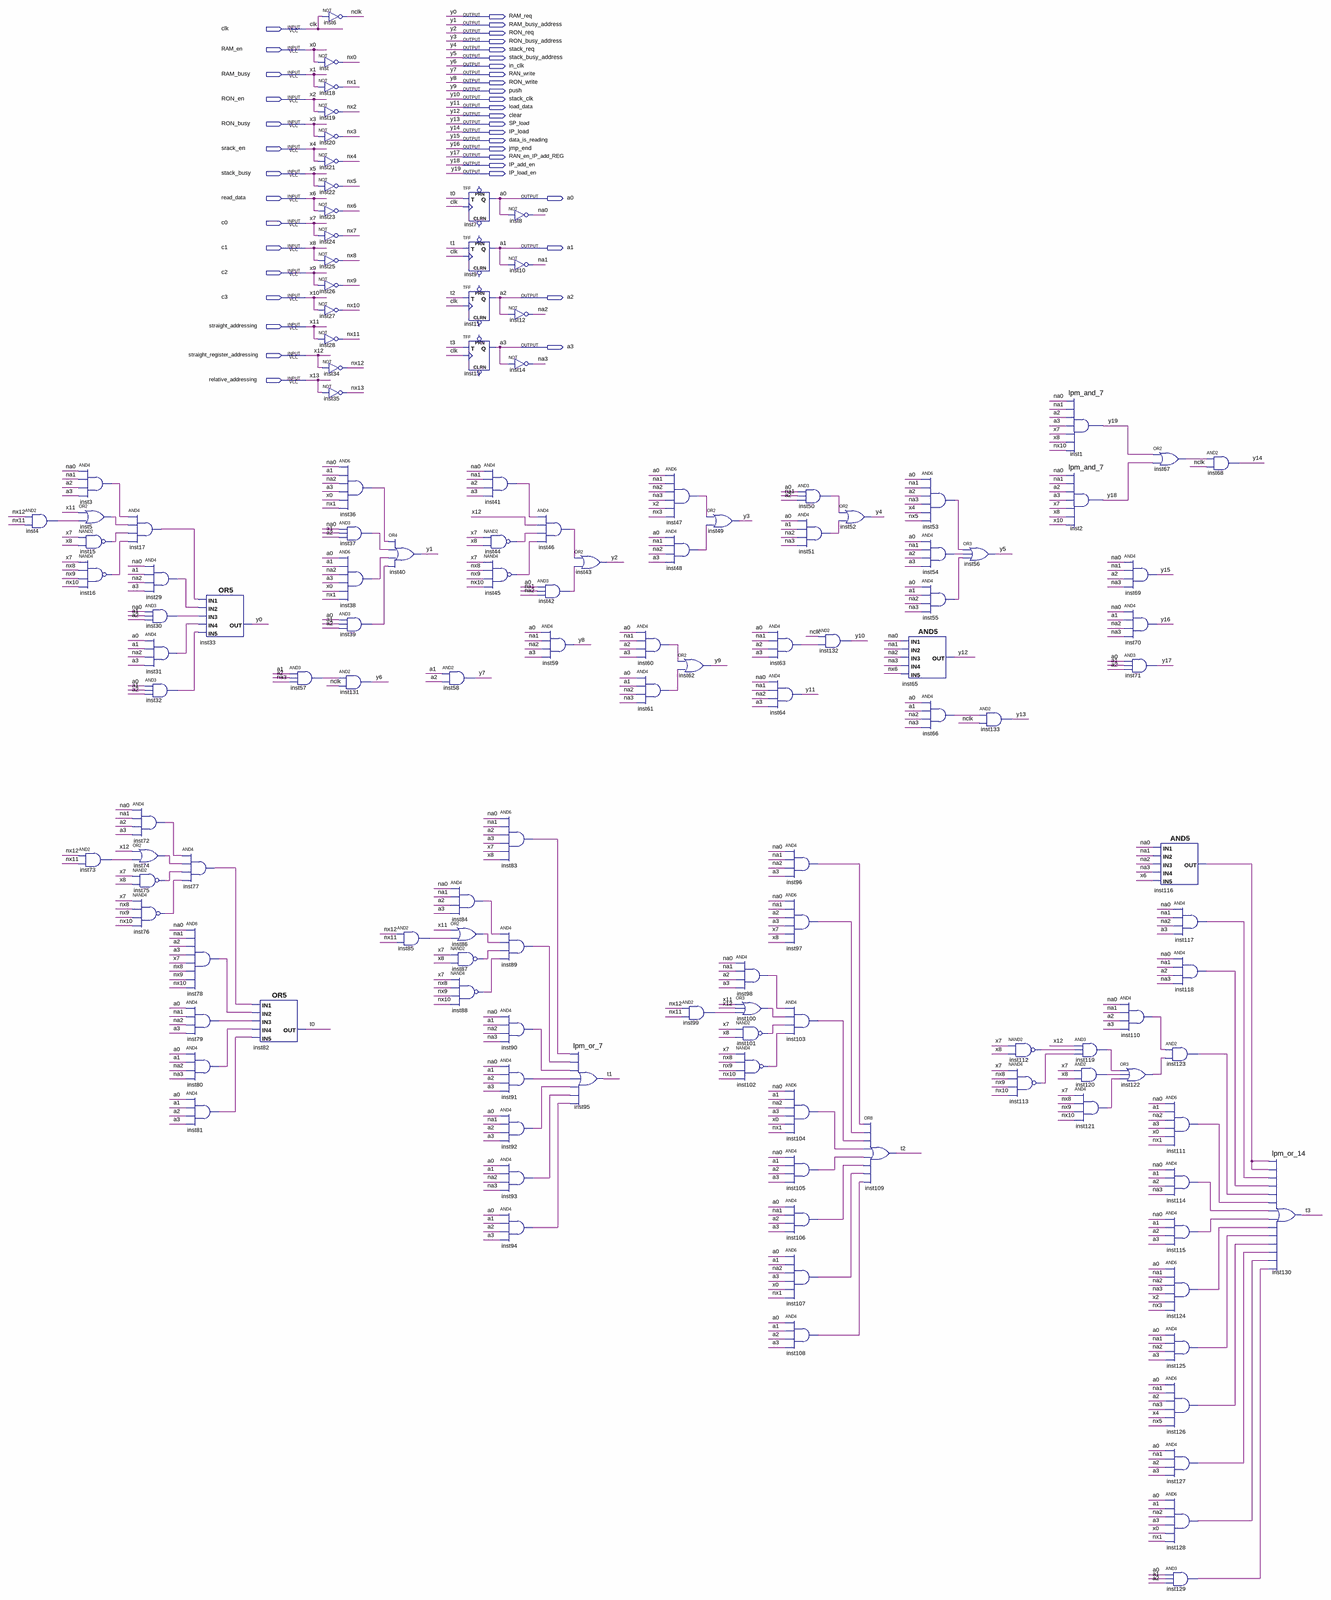
[diagram p0: schematic sheet, whole]
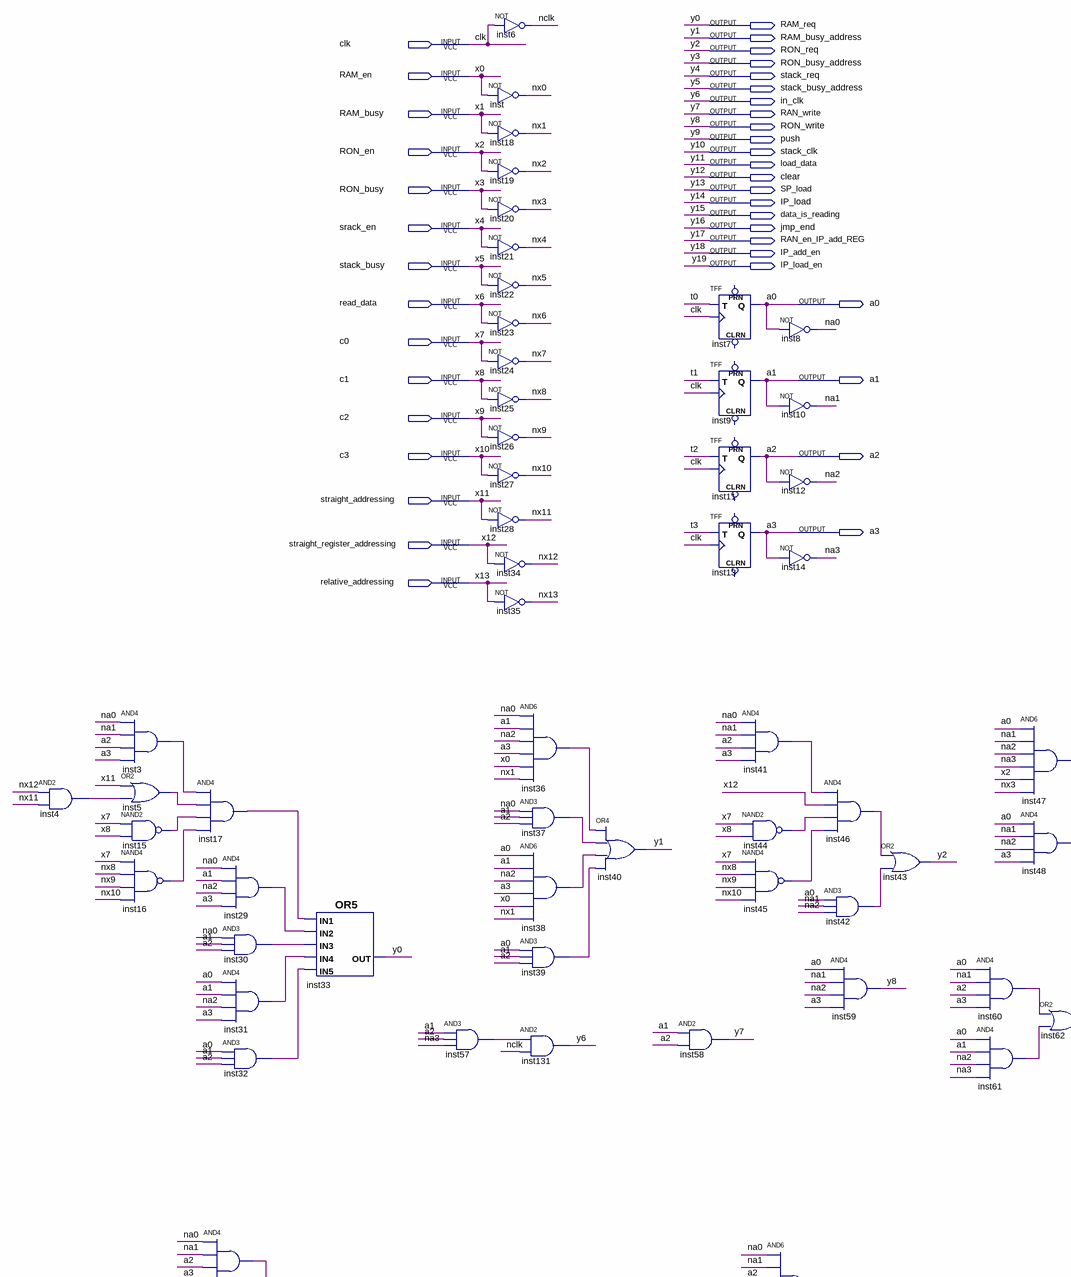
[diagram p1: schematic sheet, upper left part]
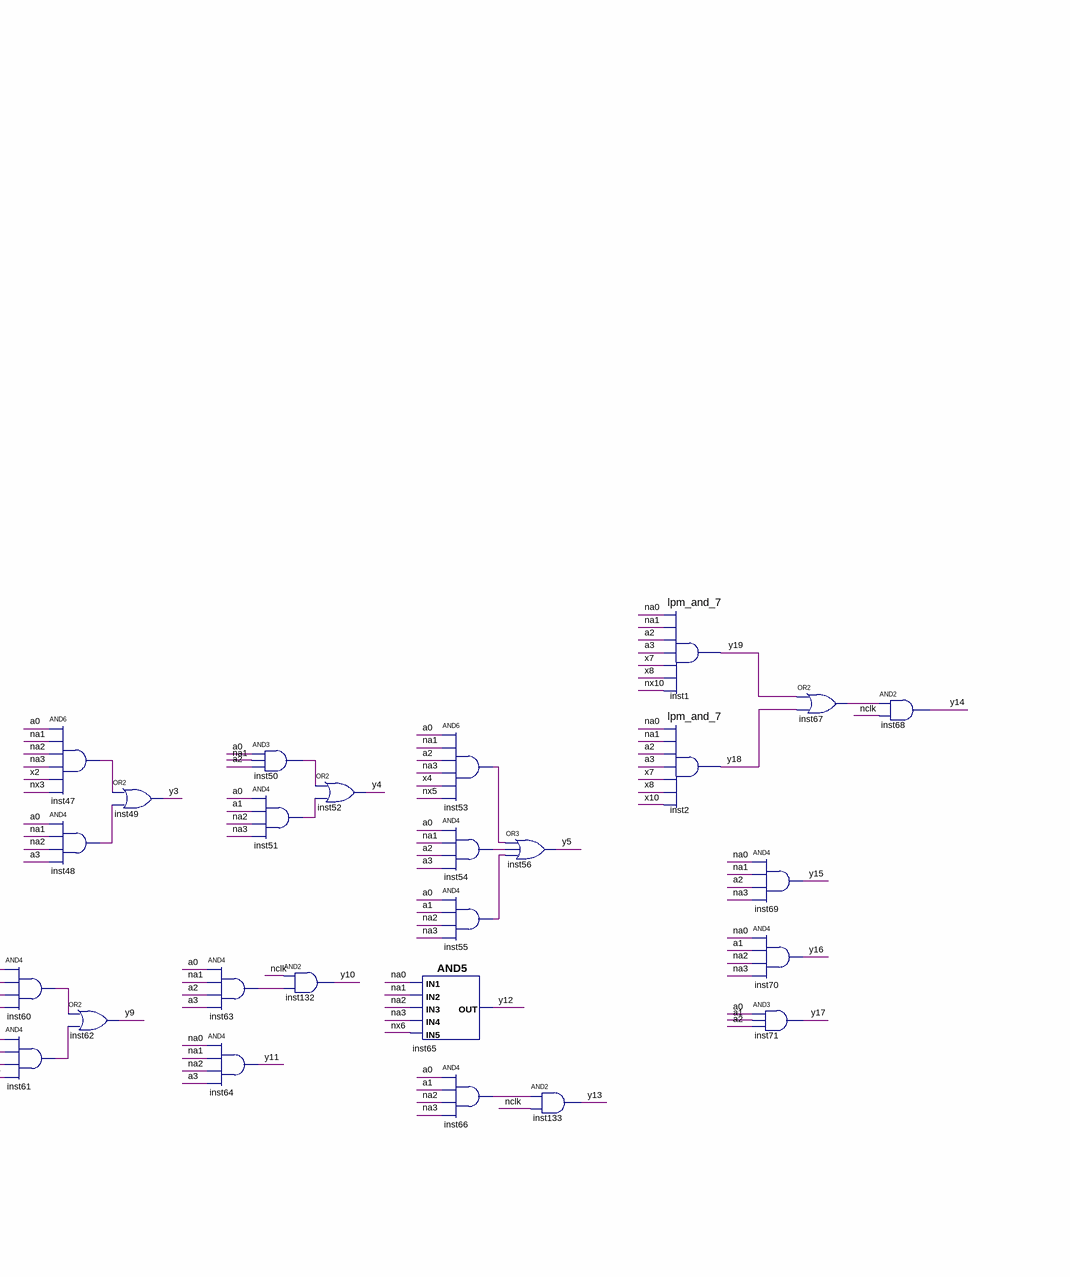
[diagram p2: schematic sheet, upper right part]
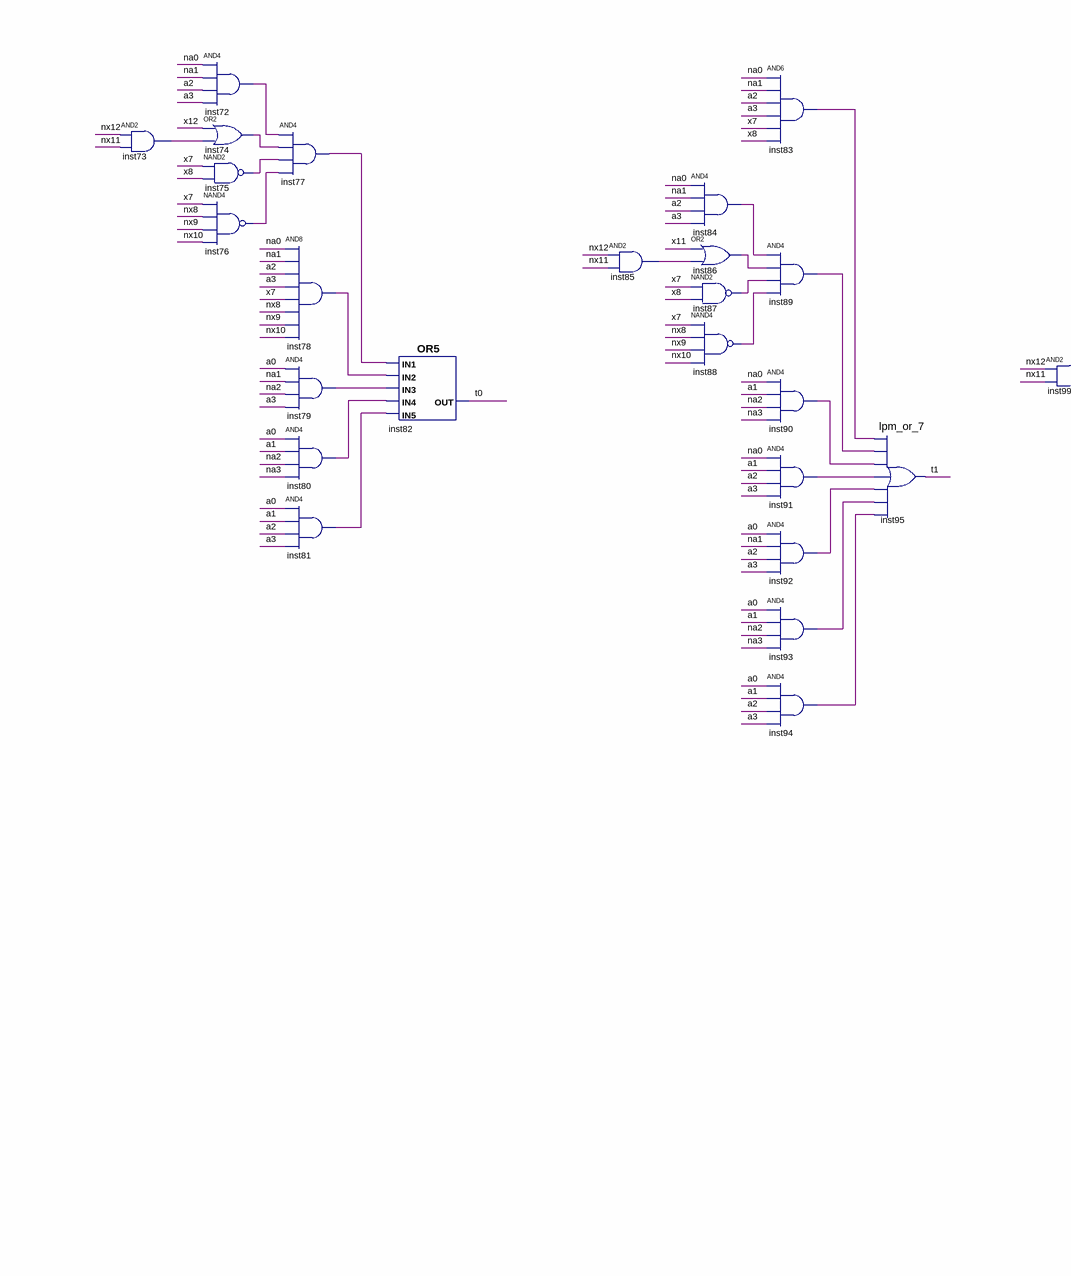
[diagram p3: schematic sheet, lower left part]
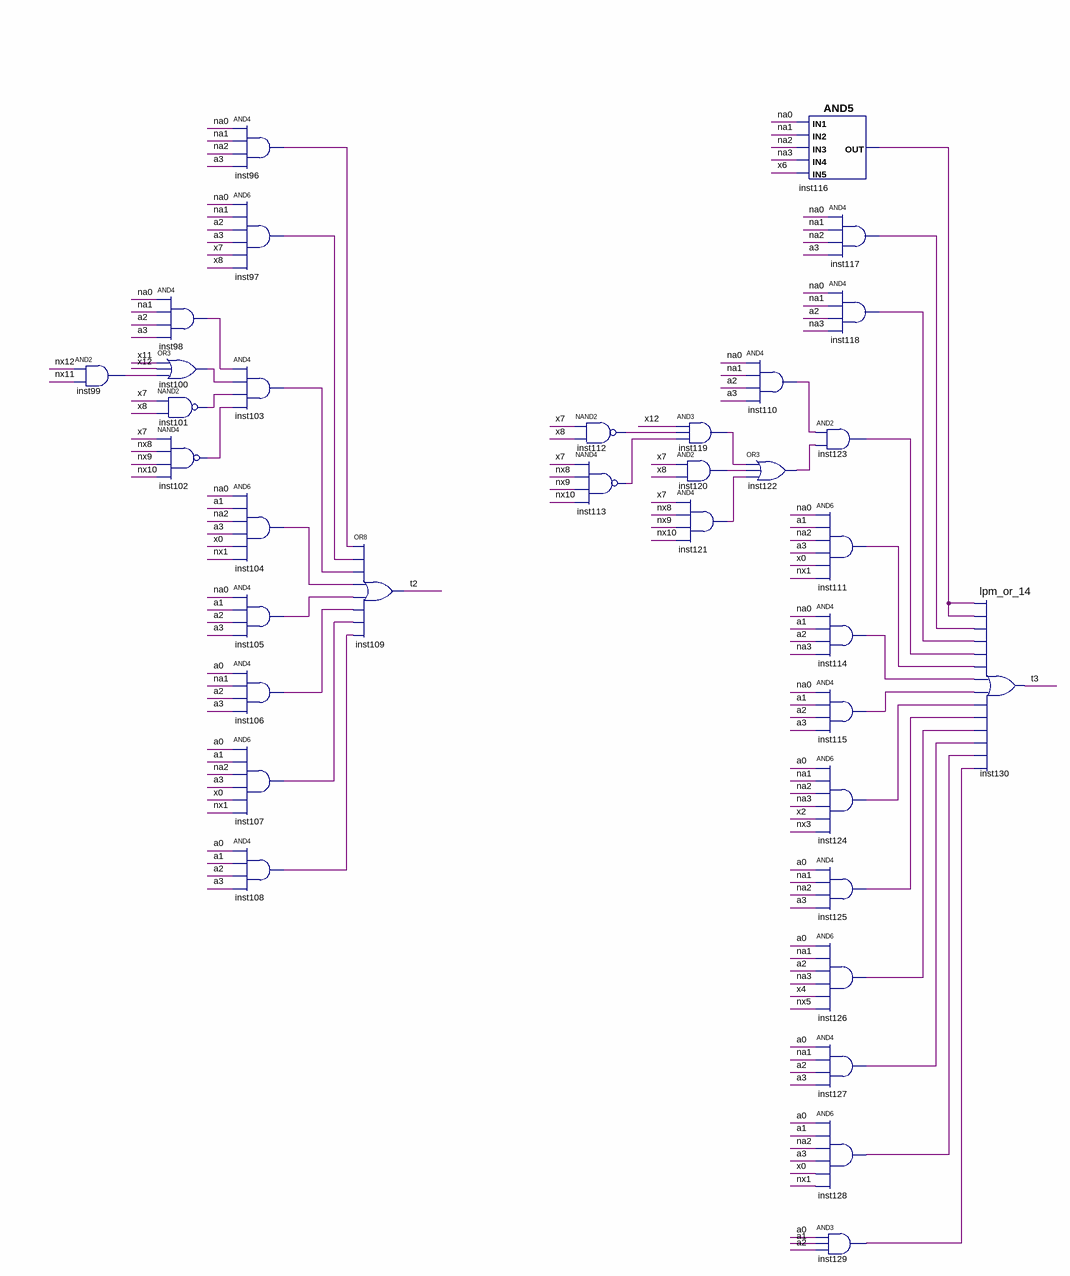
[diagram p4: schematic sheet, lower right part]
// Quartus schematic save_resault.bdf as structural Verilog: 134 symbols, 39 pins
module save_resault (
  input  clk,
  input  RAM_en,
  input  RAM_busy,
  input  RON_en,
  input  RON_busy,
  input  srack_en,
  input  stack_busy,
  input  read_data,
  input  c0,
  input  c1,
  input  c2,
  input  c3,
  input  straight_addressing,
  input  straight_register_addressing,
  input  relative_addressing,
  output RAM_req,
  output RAM_busy_address,
  output RON_req,
  output RON_busy_address,
  output stack_req,
  output stack_busy_address,
  output in_clk,
  output RAN_write,
  output RON_write,
  output push,
  output stack_clk,
  output load_data,
  output clear,
  output SP_load,
  output IP_load,
  output data_is_reading,
  output jmp_end,
  output RAN_en_IP_add_REG,
  output IP_add_en,
  output IP_load_en,
  output a0,
  output a1,
  output a2,
  output a3
);

  wire inst3_out, inst4_out, inst5_out, inst15_out, inst16_out, inst17_out, inst29_out, inst30_out,
       inst31_out, inst32_out, inst36_out, inst37_out, inst38_out, inst39_out, inst41_out, inst42_out,
       inst44_out, inst45_out, inst46_out, inst47_out, inst48_out, inst50_out, inst51_out, inst53_out,
       inst54_out, inst55_out, inst57_out, inst60_out, inst61_out, inst63_out, inst66_out, inst67_out,
       inst72_out, inst73_out, inst74_out, inst75_out, inst76_out, inst77_out, inst78_out, inst79_out,
       inst80_out, inst81_out, inst83_out, inst84_out, inst85_out, inst86_out, inst87_out, inst88_out,
       inst89_out, inst90_out, inst91_out, inst92_out, inst93_out, inst94_out, inst96_out, inst97_out,
       inst98_out, inst99_out, inst100_out, inst101_out, inst102_out, inst103_out, inst104_out, inst105_out,
       inst106_out, inst107_out, inst108_out, inst110_out, inst111_out, inst112_out, inst113_out,
       inst114_out, inst115_out, inst116_out, inst117_out, inst118_out, inst119_out, inst120_out,
       inst121_out, inst122_out, inst123_out, inst124_out, inst125_out, inst126_out, inst127_out,
       inst128_out, inst129_out, na0, na1, na2, na3, nclk, nx0, nx1, nx2, nx3, nx4, nx5, nx6, nx7, nx8, nx9,
       nx10, nx11, nx12, nx13, t0, t1, t2, t3;

  and inst4 (inst4_out, nx12, nx11);
  and inst3 (inst3_out, na0, na1, a2, a3);
  or inst5 (inst5_out, straight_addressing, inst4_out);
  nand inst15 (inst15_out, c0, c1);
  nand inst16 (inst16_out, c0, nx8, nx9, nx10);
  and inst73 (inst73_out, nx12, nx11);
  and inst17 (inst17_out, inst3_out, inst5_out, inst15_out, inst16_out);
  and inst72 (inst72_out, na0, na1, a2, a3);
  or inst74 (inst74_out, straight_register_addressing, inst73_out);
  nand inst75 (inst75_out, c0, c1);
  nand inst76 (inst76_out, c0, nx8, nx9, nx10);
  and inst29 (inst29_out, na0, a1, na2, a3);
  and inst30 (inst30_out, na0, a1, a2);
  and inst31 (inst31_out, a0, a1, na2, a3);
  and inst32 (inst32_out, a0, a1, a2);
  or inst33 (RAM_req, inst17_out, inst29_out, inst30_out, inst31_out, inst32_out);
  and inst77 (inst77_out, inst72_out, inst74_out, inst75_out, inst76_out);
  and inst78 (inst78_out, na0, na1, a2, a3, c0, nx8, nx9, nx10);
  and inst79 (inst79_out, a0, na1, na2, a3);
  and inst80 (inst80_out, a0, a1, na2, na3);
  and inst81 (inst81_out, a0, a1, a2, a3);
  or inst82 (t0, inst77_out, inst78_out, inst79_out, inst80_out, inst81_out);
  and inst57 (inst57_out, a1, a2, na3);
  not inst6 (nclk, clk);
  not inst (nx0, RAM_en);
  not inst18 (nx1, RAM_busy);
  not inst19 (nx2, RON_en);
  not inst20 (nx3, RON_busy);
  not inst21 (nx4, srack_en);
  not inst22 (nx5, stack_busy);
  not inst23 (nx6, read_data);
  not inst24 (nx7, c0);
  not inst25 (nx8, c1);
  not inst26 (nx9, c2);
  not inst27 (nx10, c3);
  not inst28 (nx11, straight_addressing);
  not inst34 (nx12, straight_register_addressing);
  not inst35 (nx13, relative_addressing);
  and inst36 (inst36_out, na0, a1, na2, a3, RAM_en, nx1);
  and inst37 (inst37_out, na0, a1, a2);
  and inst38 (inst38_out, a0, a1, na2, a3, RAM_en, nx1);
  and inst39 (inst39_out, a0, a1, a2);
  and inst131 (in_clk, inst57_out, nclk);
  or inst40 (RAM_busy_address, inst36_out, inst37_out, inst38_out, inst39_out);
  and inst85 (inst85_out, nx12, nx11);
  TFF inst7 (.T(t0), .CLK(clk), .Q(a0));  // open: PRN, CLRN
  TFF inst9 (.T(t1), .CLK(clk), .Q(a1));  // open: PRN, CLRN
  TFF inst11 (.T(t2), .CLK(clk), .Q(a2));  // open: PRN, CLRN
  TFF inst13 (.T(t3), .CLK(clk), .Q(a3));  // open: PRN, CLRN
  and inst58 (RAN_write, a1, a2);
  and inst84 (inst84_out, na0, na1, a2, a3);
  or inst86 (inst86_out, straight_addressing, inst85_out);
  nand inst87 (inst87_out, c0, c1);
  nand inst88 (inst88_out, c0, nx8, nx9, nx10);
  and inst41 (inst41_out, na0, na1, a2, a3);
  nand inst44 (inst44_out, c0, c1);
  nand inst45 (inst45_out, c0, nx8, nx9, nx10);
  and inst83 (inst83_out, na0, na1, a2, a3, c0, c1);
  and inst89 (inst89_out, inst84_out, inst86_out, inst87_out, inst88_out);
  and inst90 (inst90_out, na0, a1, na2, na3);
  and inst91 (inst91_out, na0, a1, a2, a3);
  and inst92 (inst92_out, a0, na1, a2, a3);
  and inst93 (inst93_out, a0, a1, na2, na3);
  and inst94 (inst94_out, a0, a1, a2, a3);
  not inst8 (na0, a0);
  not inst10 (na1, a1);
  not inst12 (na2, a2);
  not inst14 (na3, a3);
  and inst46 (inst46_out, inst41_out, straight_register_addressing, inst44_out, inst45_out);
  and inst42 (inst42_out, a0, na1, na2);
  and inst59 (RON_write, a0, na1, na2, a3);
  or inst43 (RON_req, inst46_out, inst42_out);
  lpm_or_7 inst95 (
    .data0(inst83_out), .data1(inst89_out), .data2(inst90_out), .data3(inst91_out), .data4(inst92_out),
    .data5(inst93_out), .data6(inst94_out), .result(t1));
  and inst47 (inst47_out, a0, na1, na2, na3, RON_en, nx3);
  and inst48 (inst48_out, a0, na1, na2, a3);
  and inst60 (inst60_out, a0, na1, a2, a3);
  and inst61 (inst61_out, a0, a1, na2, na3);
  or inst62 (push, inst60_out, inst61_out);
  and inst99 (inst99_out, nx12, nx11);
  or inst49 (RON_busy_address, inst47_out, inst48_out);
  and inst98 (inst98_out, na0, na1, a2, a3);
  or inst100 (inst100_out, straight_addressing, straight_register_addressing, inst99_out);
  nand inst101 (inst101_out, c0, c1);
  nand inst102 (inst102_out, c0, nx8, nx9, nx10);
  and inst50 (inst50_out, a0, na1, a2);
  and inst51 (inst51_out, a0, a1, na2, na3);
  and inst63 (inst63_out, a0, na1, a2, a3);
  and inst64 (load_data, na0, na1, na2, a3);
  and inst96 (inst96_out, na0, na1, na2, a3);
  and inst97 (inst97_out, na0, na1, a2, a3, c0, c1);
  and inst103 (inst103_out, inst98_out, inst100_out, inst101_out, inst102_out);
  and inst104 (inst104_out, na0, a1, na2, a3, RAM_en, nx1);
  and inst105 (inst105_out, na0, a1, a2, a3);
  and inst106 (inst106_out, a0, na1, a2, a3);
  and inst107 (inst107_out, a0, a1, na2, a3, RAM_en, nx1);
  and inst108 (inst108_out, a0, a1, a2, a3);
  and inst132 (stack_clk, nclk, inst63_out);
  or inst52 (stack_req, inst50_out, inst51_out);
  or inst109 (t2, inst96_out, inst97_out, inst103_out, inst104_out, inst105_out, inst106_out, inst107_out, inst108_out);
  and inst53 (inst53_out, a0, na1, a2, na3, srack_en, nx5);
  and inst54 (inst54_out, a0, na1, a2, a3);
  and inst55 (inst55_out, a0, a1, na2, na3);
  and inst65 (clear, na0, na1, na2, na3, nx6);
  and inst66 (inst66_out, a0, a1, na2, na3);
  or inst56 (stack_busy_address, inst53_out, inst54_out, inst55_out);
  and inst133 (SP_load, inst66_out, nclk);
  nand inst112 (inst112_out, c0, c1);
  nand inst113 (inst113_out, c0, nx8, nx9, nx10);
  lpm_and_7 inst1 (
    .data0(na0), .data1(na1), .data2(a2), .data3(a3), .data4(c0), .data5(c1), .data6(nx10),
    .result(IP_load_en));
  lpm_and_7 inst2 (
    .data0(na0), .data1(na1), .data2(a2), .data3(a3), .data4(c0), .data5(c1), .data6(c3), .result(IP_add_en));
  and inst119 (inst119_out, straight_register_addressing, inst112_out, inst113_out);
  and inst120 (inst120_out, c0, c1);
  and inst121 (inst121_out, c0, nx8, nx9, nx10);
  and inst69 (data_is_reading, na0, na1, a2, na3);
  and inst70 (jmp_end, na0, a1, na2, na3);
  and inst71 (RAN_en_IP_add_REG, a0, a1, a2);
  and inst110 (inst110_out, na0, na1, a2, a3);
  or inst122 (inst122_out, inst119_out, inst120_out, inst121_out);
  or inst67 (inst67_out, IP_load_en, IP_add_en);
  and inst116 (inst116_out, na0, na1, na2, na3, read_data);
  and inst117 (inst117_out, na0, na1, na2, a3);
  and inst118 (inst118_out, na0, na1, a2, na3);
  and inst123 (inst123_out, inst110_out, inst122_out);
  and inst111 (inst111_out, na0, a1, na2, a3, RAM_en, nx1);
  and inst114 (inst114_out, na0, a1, a2, na3);
  and inst115 (inst115_out, na0, a1, a2, a3);
  and inst124 (inst124_out, a0, na1, na2, na3, RON_en, nx3);
  and inst125 (inst125_out, a0, na1, na2, a3);
  and inst126 (inst126_out, a0, na1, a2, na3, srack_en, nx5);
  and inst127 (inst127_out, a0, na1, a2, a3);
  and inst128 (inst128_out, a0, a1, na2, a3, RAM_en, nx1);
  and inst129 (inst129_out, a0, a1, a2);
  and inst68 (IP_load, inst67_out, nclk);
  lpm_or_14 inst130 (
    .data0(inst116_out), .data1(inst116_out), .data2(inst117_out), .data3(inst118_out), .data4(inst123_out),
    .data5(inst111_out), .data6(inst114_out), .data7(inst115_out), .data8(inst124_out), .data9(inst125_out),
    .data10(inst126_out), .data11(inst127_out), .data12(inst128_out), .data13(inst129_out), .result(t3));

  // Other names for the same wires on the sheet: x10 = c3; x11 = straight_addressing;
  //   x12 = straight_register_addressing; x0 = RAM_en; x1 = RAM_busy; x2 = RON_en; x3 = RON_busy; x4 = srack_en;
  //   x5 = stack_busy; x6 = read_data; x7 = c0; x8 = c1; x9 = c2; x13 = relative_addressing; y0 = RAM_req;
  //   y1 = RAM_busy_address; y2 = RON_req; y3 = RON_busy_address; y4 = stack_req; y5 = stack_busy_address;
  //   y6 = in_clk; y7 = RAN_write; y8 = RON_write; y9 = push; y10 = stack_clk; y11 = load_data; y12 = clear;
  //   y13 = SP_load; y14 = IP_load; y15 = data_is_reading; y16 = jmp_end; y17 = RAN_en_IP_add_REG; y18 = IP_add_en;
  //   y19 = IP_load_en
endmodule
